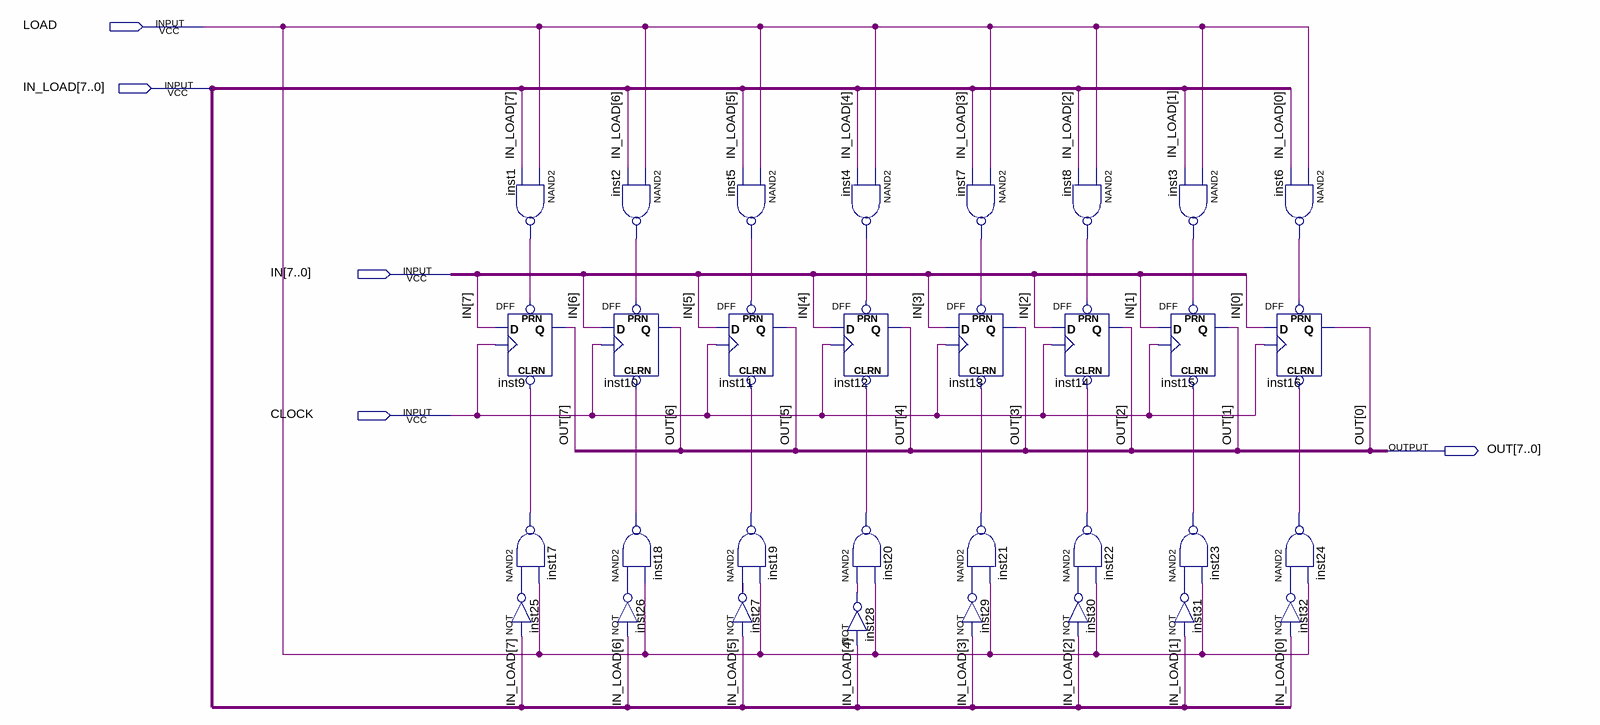
[diagram p0: schematic sheet]
// Quartus schematic REGISTER_8bit.bdf as structural Verilog: 32 symbols, 5 pins
module REGISTER_8bit (
  input  LOAD,
  input  [7:0] IN_LOAD,
  input  [7:0] IN,
  input  CLOCK,
  output [7:0] OUT
);

  wire inst1_out, inst2_out, inst3_out, inst4_out, inst5_out, inst6_out, inst7_out, inst8_out, inst17_out,
       inst18_out, inst19_out, inst20_out, inst21_out, inst22_out, inst23_out, inst24_out, inst25_out,
       inst26_out, inst27_out, inst28_out, inst29_out, inst30_out, inst31_out, inst32_out;

  nand inst1 (inst1_out, LOAD, IN_LOAD[7]);
  DFF inst9 (.CLRN(inst17_out), .CLK(CLOCK), .D(IN[7]), .PRN(inst1_out), .Q(OUT[7]));
  nand inst17 (inst17_out, inst25_out, LOAD);
  not inst25 (inst25_out, IN_LOAD[7]);
  nand inst2 (inst2_out, LOAD, IN_LOAD[6]);
  DFF inst10 (.CLRN(inst18_out), .CLK(CLOCK), .D(IN[6]), .PRN(inst2_out), .Q(OUT[6]));
  nand inst18 (inst18_out, inst26_out, LOAD);
  not inst26 (inst26_out, IN_LOAD[6]);
  nand inst5 (inst5_out, LOAD, IN_LOAD[5]);
  DFF inst11 (.CLRN(inst19_out), .CLK(CLOCK), .D(IN[5]), .PRN(inst5_out), .Q(OUT[5]));
  nand inst19 (inst19_out, inst27_out, LOAD);
  not inst27 (inst27_out, IN_LOAD[5]);
  DFF inst12 (.CLRN(inst20_out), .CLK(CLOCK), .D(IN[4]), .PRN(inst4_out), .Q(OUT[4]));
  nand inst4 (inst4_out, LOAD, IN_LOAD[4]);
  nand inst20 (inst20_out, inst28_out, LOAD);
  not inst28 (inst28_out, IN_LOAD[4]);
  nand inst7 (inst7_out, LOAD, IN_LOAD[3]);
  DFF inst13 (.CLRN(inst21_out), .CLK(CLOCK), .D(IN[3]), .PRN(inst7_out), .Q(OUT[3]));
  nand inst21 (inst21_out, inst29_out, LOAD);
  not inst29 (inst29_out, IN_LOAD[3]);
  nand inst8 (inst8_out, LOAD, IN_LOAD[2]);
  DFF inst14 (.CLRN(inst22_out), .CLK(CLOCK), .D(IN[2]), .PRN(inst8_out), .Q(OUT[2]));
  nand inst22 (inst22_out, inst30_out, LOAD);
  not inst30 (inst30_out, IN_LOAD[2]);
  nand inst3 (inst3_out, LOAD, IN_LOAD[1]);
  DFF inst15 (.CLRN(inst23_out), .CLK(CLOCK), .D(IN[1]), .PRN(inst3_out), .Q(OUT[1]));
  nand inst23 (inst23_out, inst31_out, LOAD);
  not inst31 (inst31_out, IN_LOAD[1]);
  nand inst6 (inst6_out, LOAD, IN_LOAD[0]);
  DFF inst16 (.CLRN(inst24_out), .CLK(CLOCK), .D(IN[0]), .PRN(inst6_out), .Q(OUT[0]));
  nand inst24 (inst24_out, inst32_out, LOAD);
  not inst32 (inst32_out, IN_LOAD[0]);
endmodule
